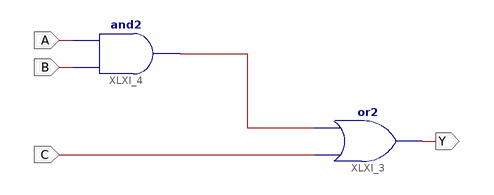
[diagram p0: schematic sheet 1]
// Xilinx ISE schematic circuit1.sch (artix7) as structural Verilog: 2 symbols, 4 ports
module circuit1 (
  input  A,
  input  B,
  input  C,
  output Y
);

  wire XLXN_1;

  or XLXI_3 (Y, C, XLXN_1);
  and XLXI_4 (XLXN_1, B, A);
endmodule
